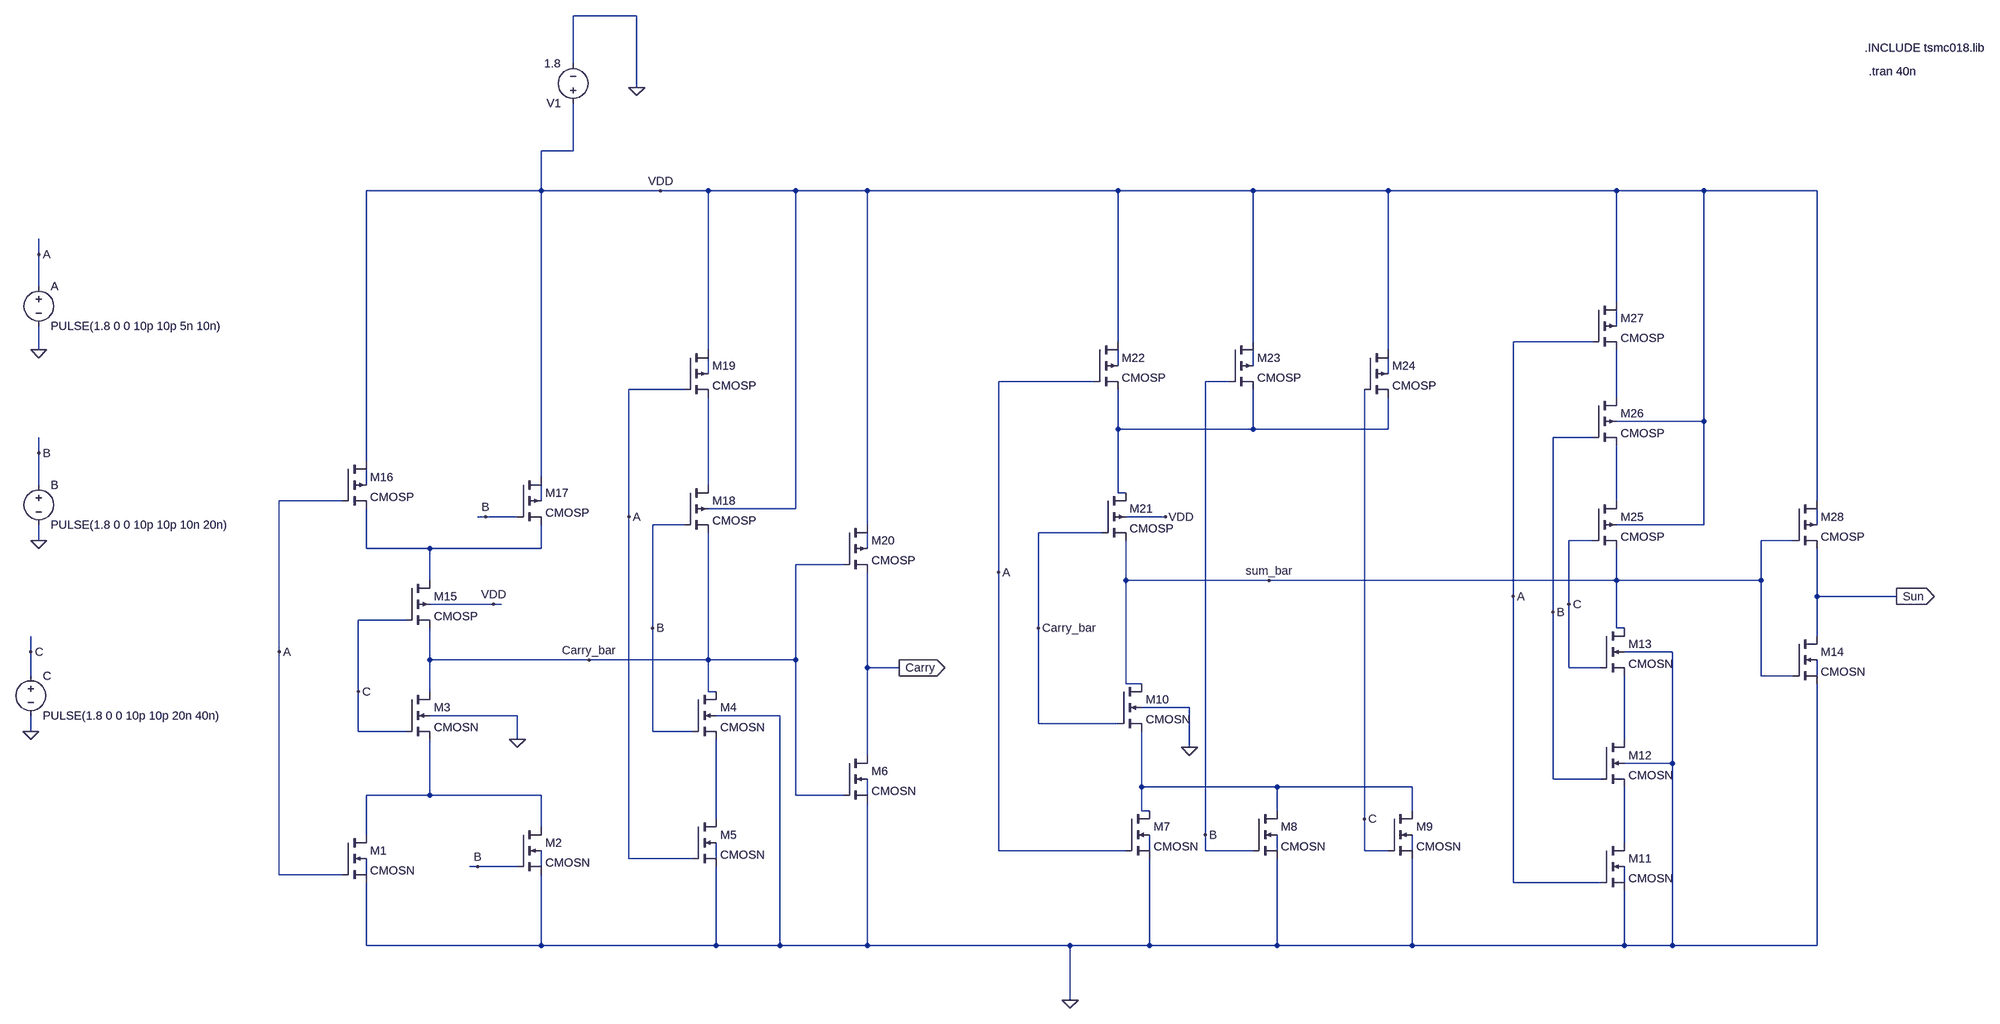
[diagram p0: schematic adder.asc]
adder.asc, the LTspice schematic file:
Version 4
SHEET 1 1956 1172
WIRE -832 -944 -960 -944
WIRE -960 -848 -960 -944
WIRE -832 -800 -832 -944
WIRE -960 -672 -960 -768
WIRE -960 -672 -1024 -672
WIRE -1024 -592 -1024 -672
WIRE -1024 -592 -1376 -592
WIRE -784 -592 -1024 -592
WIRE -688 -592 -784 -592
WIRE -512 -592 -688 -592
WIRE -368 -592 -512 -592
WIRE 144 -592 -368 -592
WIRE 416 -592 144 -592
WIRE 688 -592 416 -592
WIRE 1152 -592 688 -592
WIRE 1328 -592 1152 -592
WIRE 1600 -592 1328 -592
WIRE -2288 -464 -2288 -496
WIRE -2288 -400 -2288 -464
WIRE 1152 -368 1152 -592
WIRE 1152 -320 1152 -352
WIRE 144 -288 144 -592
WIRE 416 -288 416 -592
WIRE 1104 -288 944 -288
WIRE -2288 -272 -2288 -320
WIRE -688 -272 -688 -592
WIRE 688 -272 688 -592
WIRE 144 -240 144 -272
WIRE 416 -240 416 -272
WIRE -688 -224 -688 -256
WIRE 688 -224 688 -256
WIRE 96 -208 -96 -208
WIRE 368 -208 320 -208
WIRE -736 -192 -848 -192
WIRE 1152 -176 1152 -272
WIRE 1328 -128 1328 -592
WIRE 1328 -128 1152 -128
WIRE 144 -112 144 -192
WIRE 416 -112 416 -192
WIRE 416 -112 144 -112
WIRE 688 -112 688 -176
WIRE 688 -112 416 -112
WIRE 1104 -96 1024 -96
WIRE -2288 -64 -2288 -96
WIRE -1376 -48 -1376 -592
WIRE -1024 -16 -1024 -592
WIRE -2288 0 -2288 -64
WIRE -1376 0 -1376 -32
WIRE -688 0 -688 -176
WIRE 144 16 144 -112
WIRE 160 16 144 16
WIRE -1424 32 -1648 32
WIRE -1024 32 -1024 0
WIRE 1152 32 1152 -80
WIRE 1600 32 1600 -592
WIRE -512 48 -512 -592
WIRE -512 48 -688 48
WIRE -1136 64 -1152 64
WIRE -1072 64 -1136 64
WIRE -848 64 -848 -192
WIRE 240 64 160 64
WIRE -736 80 -800 80
WIRE -368 80 -368 -592
WIRE 1328 80 1328 -128
WIRE 1328 80 1152 80
WIRE 1600 80 1600 48
WIRE 112 96 -16 96
WIRE -2288 112 -2288 80
WIRE 1104 112 1056 112
WIRE 1552 112 1488 112
WIRE -1376 128 -1376 48
WIRE -1248 128 -1376 128
WIRE -1024 128 -1024 80
WIRE -1024 128 -1248 128
WIRE -368 128 -368 96
WIRE -416 160 -512 160
WIRE -96 176 -96 -208
WIRE -1248 192 -1248 128
WIRE 160 192 160 112
WIRE 448 192 160 192
WIRE 1152 192 1152 128
WIRE 1152 192 448 192
WIRE 1488 192 1488 112
WIRE 1488 192 1152 192
WIRE 944 224 944 -288
WIRE 1600 224 1600 128
WIRE 1760 224 1600 224
WIRE -1120 240 -1248 240
WIRE -1104 240 -1120 240
WIRE 1056 240 1056 112
WIRE 1024 256 1024 -96
WIRE -1296 272 -1392 272
WIRE -800 288 -800 80
WIRE -16 288 -16 96
WIRE 1152 288 1152 192
WIRE 1168 288 1152 288
WIRE 1600 304 1600 224
WIRE -2304 336 -2304 304
WIRE -1648 336 -1648 32
WIRE 1264 336 1168 336
WIRE -1248 352 -1248 288
WIRE -928 352 -1248 352
WIRE -688 352 -688 96
WIRE -688 352 -928 352
WIRE -512 352 -512 160
WIRE -512 352 -688 352
WIRE -368 368 -368 176
WIRE -304 368 -368 368
WIRE 1056 368 1056 240
WIRE 1120 368 1056 368
WIRE -2304 384 -2304 336
WIRE 1488 384 1488 192
WIRE 1552 384 1488 384
WIRE 1600 384 1600 352
WIRE 160 400 160 192
WIRE 192 400 160 400
WIRE -1392 416 -1392 272
WIRE -1248 416 -1248 352
WIRE -688 416 -688 352
WIRE -672 416 -688 416
WIRE 288 448 192 448
WIRE -1072 464 -1248 464
WIRE -544 464 -672 464
WIRE -16 480 -16 288
WIRE 144 480 -16 480
WIRE -2304 496 -2304 464
WIRE -1392 496 -1392 416
WIRE -1296 496 -1392 496
WIRE -800 496 -800 288
WIRE -720 496 -800 496
WIRE -1072 512 -1072 464
WIRE 1168 512 1168 384
WIRE 288 528 288 448
WIRE -368 544 -368 368
WIRE 1264 560 1264 336
WIRE 1264 560 1168 560
WIRE 1024 592 1024 256
WIRE 1120 592 1024 592
WIRE 192 608 192 496
WIRE 464 608 192 608
WIRE 736 608 464 608
WIRE -1248 624 -1248 512
WIRE -1248 624 -1376 624
WIRE -1024 624 -1248 624
WIRE -512 624 -512 352
WIRE -416 624 -512 624
WIRE -368 624 -368 592
WIRE 192 656 192 608
WIRE 208 656 192 656
WIRE 464 656 464 608
WIRE 736 656 736 608
WIRE -672 672 -672 512
WIRE 640 672 640 -192
WIRE -1024 688 -1024 624
WIRE -1376 704 -1376 624
WIRE 320 704 320 -208
WIRE 1168 720 1168 608
WIRE -96 736 -96 176
WIRE 160 736 -96 736
WIRE 208 736 208 704
WIRE 320 736 320 704
WIRE 416 736 320 736
WIRE 464 736 464 704
WIRE 640 736 640 672
WIRE 688 736 640 736
WIRE 736 736 736 704
WIRE -848 752 -848 64
WIRE -720 752 -848 752
WIRE -672 752 -672 720
WIRE -1152 768 -1168 768
WIRE -1072 768 -1152 768
WIRE -1024 768 -1024 736
WIRE -1648 784 -1648 336
WIRE -1424 784 -1648 784
WIRE -1376 784 -1376 752
WIRE 944 800 944 224
WIRE 1120 800 944 800
WIRE 1168 800 1168 768
WIRE -1376 960 -1376 800
WIRE -1024 960 -1024 784
WIRE -1024 960 -1376 960
WIRE -672 960 -672 768
WIRE -672 960 -1024 960
WIRE -544 960 -544 464
WIRE -544 960 -672 960
WIRE -368 960 -368 640
WIRE -368 960 -544 960
WIRE 48 960 -368 960
WIRE 208 960 208 752
WIRE 208 960 48 960
WIRE 464 960 464 752
WIRE 464 960 208 960
WIRE 736 960 736 752
WIRE 736 960 464 960
WIRE 1168 960 1168 816
WIRE 1168 960 736 960
WIRE 1264 960 1264 560
WIRE 1264 960 1168 960
WIRE 1600 960 1600 400
WIRE 1600 960 1264 960
WIRE 48 1152 48 960
FLAG 48 1152 0
FLAG -1072 512 0
FLAG 288 528 0
FLAG -2304 496 0
FLAG -2288 112 0
FLAG -2288 -272 0
FLAG -832 -800 0
FLAG -1120 240 VDD
FLAG 240 64 VDD
FLAG -2304 336 C
FLAG -1392 416 C
FLAG 1056 240 C
FLAG 640 672 C
FLAG -1136 64 B
FLAG -1152 768 B
FLAG -2288 -64 B
FLAG -800 288 B
FLAG 320 704 B
FLAG -2288 -464 A
FLAG -1648 336 A
FLAG -848 64 A
FLAG -96 176 A
FLAG 944 224 A
FLAG 1024 256 B
FLAG 1760 224 Sun
IOPIN 1760 224 Out
FLAG -304 368 Carry
IOPIN -304 368 Out
FLAG -928 352 Carry_bar
FLAG -16 288 Carry_bar
FLAG -784 -592 VDD
FLAG 448 192 sum_bar
SYMBOL cmosn -1424 704 R0
SYMATTR InstName M1
SYMATTR Value2 l=180n w=1600n
SYMBOL cmosn -1072 688 R0
SYMATTR InstName M2
SYMATTR Value2 l=180n w=1600n
SYMBOL cmosn -1296 416 R0
SYMATTR InstName M3
SYMATTR Value2 l=180n w=1600n
SYMBOL cmosn -720 416 R0
SYMATTR InstName M4
SYMATTR Value2 l=180n w=1600n
SYMBOL cmosn -720 672 R0
SYMATTR InstName M5
SYMATTR Value2 l=180n w=1600n
SYMBOL cmosn -416 544 R0
SYMATTR InstName M6
SYMATTR Value2 l=180n w=400n
SYMBOL cmosn 160 656 R0
SYMATTR InstName M7
SYMATTR Value2 l=180n w=800n
SYMBOL cmosn 416 656 R0
SYMATTR InstName M8
SYMATTR Value2 l=180n w=800n
SYMBOL cmosn 688 656 R0
SYMATTR InstName M9
SYMATTR Value2 l=180n w=800n
SYMBOL cmosn 144 400 R0
SYMATTR InstName M10
SYMATTR Value2 l=180n w=800n
SYMBOL cmosn 1120 720 R0
SYMATTR InstName M11
SYMATTR Value2 l=180n w=1200n
SYMBOL cmosn 1120 512 R0
SYMATTR InstName M12
SYMATTR Value2 l=180n w=1200n
SYMBOL cmosn 1120 288 R0
SYMATTR InstName M13
SYMATTR Value2 l=180n w=1200n
SYMBOL cmosn 1552 304 R0
SYMATTR InstName M14
SYMATTR Value2 l=180n w=400n
SYMBOL cmosp -1296 192 R0
SYMATTR InstName M15
SYMATTR Value2 l=180n w=3200n
SYMBOL cmosp -1424 -48 R0
SYMATTR InstName M16
SYMATTR Value2 l=180n w=3200n
SYMBOL cmosp -1072 -16 R0
SYMATTR InstName M17
SYMATTR Value2 l=180n w=3200n
SYMBOL cmosp -736 0 R0
SYMATTR InstName M18
SYMATTR Value2 l=180n w=3200n
SYMBOL cmosp -736 -272 R0
SYMATTR InstName M19
SYMATTR Value2 l=180n w=3200n
SYMBOL cmosp -416 80 R0
SYMATTR InstName M20
SYMATTR Value2 l=180n w=800n
SYMBOL cmosp 112 16 R0
SYMATTR InstName M21
SYMATTR Value2 l=180n w=1600n
SYMBOL cmosp 96 -288 R0
SYMATTR InstName M22
SYMATTR Value2 l=180n w=1600n
SYMBOL cmosp 368 -288 R0
SYMATTR InstName M23
SYMATTR Value2 l=180n w=1600n
SYMBOL cmosp 640 -272 R0
SYMATTR InstName M24
SYMATTR Value2 l=180n w=1600n
SYMBOL cmosp 1104 32 R0
SYMATTR InstName M25
SYMATTR Value2 l=180n w=2400n
SYMBOL cmosp 1104 -176 R0
SYMATTR InstName M26
SYMATTR Value2 l=180n w=2400n
SYMBOL cmosp 1104 -368 R0
SYMATTR InstName M27
SYMATTR Value2 l=180n w=2400n
SYMBOL cmosp 1552 32 R0
SYMATTR InstName M28
SYMATTR Value2 l=180n w=800n
SYMBOL voltage -960 -752 R180
WINDOW 123 0 0 Left 0
WINDOW 39 0 0 Left 0
SYMATTR InstName V1
SYMATTR Value 1.8
SYMBOL voltage -2288 -416 R0
WINDOW 123 0 0 Left 0
WINDOW 39 0 0 Left 0
SYMATTR InstName A
SYMATTR Value PULSE(1.8 0 0 10p 10p 5n 10n)
SYMBOL voltage -2288 -16 R0
WINDOW 123 0 0 Left 0
WINDOW 39 0 0 Left 0
SYMATTR InstName B
SYMATTR Value PULSE(1.8 0 0 10p 10p 10n 20n)
SYMBOL voltage -2304 368 R0
WINDOW 123 0 0 Left 0
WINDOW 39 0 0 Left 0
SYMATTR InstName C
SYMATTR Value PULSE(1.8 0 0 10p 10p 20n 40n)
TEXT 1696 -880 Left 2 !.INCLUDE tsmc018.lib
TEXT 1704 -832 Left 2 !.tran 40n

The netlist it stands for:
* adder.asc
M1 N018 A 0 N027 CMOSN l=180n w=1600n
M2 N018 B 0 N026 CMOSN l=180n w=1600n
M3 Carry_bar C N018 0 CMOSN l=180n w=1600n
M4 Carry_bar B N020 0 CMOSN l=180n w=1600n
M5 N020 A 0 N025 CMOSN l=180n w=1600n
M6 Carry Carry_bar 0 N019 CMOSN l=180n w=400n
M7 N017 A 0 N022 CMOSN l=180n w=800n
M8 N017 B 0 N023 CMOSN l=180n w=800n
M9 N017 C 0 N024 CMOSN l=180n w=800n
M10 sum_bar Carry_bar N017 0 CMOSN l=180n w=800n
M11 N021 A 0 N028 CMOSN l=180n w=1200n
M12 N016 B N021 0 CMOSN l=180n w=1200n
M13 sum_bar C N016 0 CMOSN l=180n w=1200n
M14 Sun sum_bar 0 N015 CMOSN l=180n w=400n
M15 N013 C Carry_bar VDD CMOSP l=180n w=3200n
M16 VDD A N013 N008 CMOSP l=180n w=3200n
M17 VDD B N013 N010 CMOSP l=180n w=3200n
M18 N009 B Carry_bar VDD CMOSP l=180n w=3200n
M19 VDD A N009 N004 CMOSP l=180n w=3200n
M20 VDD Carry_bar Carry N014 CMOSP l=180n w=800n
M21 N007 Carry_bar sum_bar VDD CMOSP l=180n w=1600n
M22 VDD A N007 N002 CMOSP l=180n w=1600n
M23 VDD B N007 N003 CMOSP l=180n w=1600n
M24 VDD C N007 N005 CMOSP l=180n w=1600n
M25 N011 C sum_bar VDD CMOSP l=180n w=2400n
M26 N006 B N011 VDD CMOSP l=180n w=2400n
M27 VDD A N006 N001 CMOSP l=180n w=2400n
M28 VDD sum_bar Sun N012 CMOSP l=180n w=800n
V1 VDD 0 1.8
V§A A 0 PULSE(1.8 0 0 10p 10p 5n 10n)
V§B B 0 PULSE(1.8 0 0 10p 10p 10n 20n)
V§C C 0 PULSE(1.8 0 0 10p 10p 20n 40n)
.model NMOS NMOS
.model PMOS PMOS
.lib standard.mos
.INCLUDE tsmc018.lib
.tran 40n
.backanno
.end